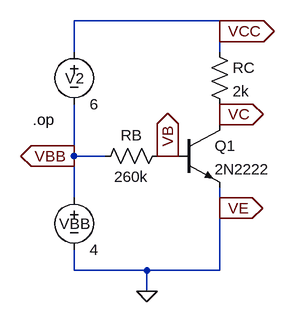
[diagram p0: schematic exam5_03c.asc]
exam5_03c.asc, the LTspice schematic file:
Version 4
SHEET 1 880 680
WIRE 224 -48 0 -48
WIRE 224 -32 224 -48
WIRE 0 0 0 -48
WIRE 224 0 224 -32
WIRE 224 96 224 80
WIRE 224 112 224 96
WIRE 0 160 0 80
WIRE 48 160 0 160
WIRE 144 160 128 160
WIRE 160 160 144 160
WIRE 0 224 0 160
WIRE 224 240 224 208
WIRE 0 336 0 304
WIRE 112 336 0 336
WIRE 224 336 224 240
WIRE 224 336 112 336
WIRE 112 368 112 336
FLAG 112 368 0
FLAG 224 -32 VCC
IOPIN 224 -32 Out
FLAG 144 160 VB
IOPIN 144 160 Out
FLAG 224 240 VE
IOPIN 224 240 Out
FLAG 0 160 VBB
IOPIN 0 160 Out
FLAG 224 96 VC
IOPIN 224 96 Out
SYMBOL npn 160 112 R0
SYMATTR InstName Q1
SYMATTR Value 2N2222
SYMBOL res 208 -16 R0
SYMATTR InstName RC
SYMATTR Value 2k
SYMBOL res 144 144 R90
WINDOW 0 0 56 VBottom 2
WINDOW 3 32 56 VTop 2
SYMATTR InstName RB
SYMATTR Value 260k
SYMBOL voltage 0 208 R0
WINDOW 0 -23 56 Left 2
SYMATTR InstName VBB
SYMATTR Value 4
SYMBOL voltage 0 -16 R0
WINDOW 0 -14 56 Left 2
SYMATTR InstName V2
SYMATTR Value 6
TEXT -64 104 Left 2 !.op

The netlist it stands for:
* exam5_03c.asc
Q1 VC VB 0 0 2N2222
RC VCC VC 2k
RB VB VBB 260k
VBB VBB 0 4
V2 VCC VBB 6
.model NPN NPN
.model PNP PNP
.lib standard.bjt
.op
.backanno
.end

* Results of the author's LTspice run, read from the files saved beside the schematic
* Operating Point:
*   V(vc) = 4.73 V
*   V(vb) = 680 mV
*   V(vcc) = 10 V
*   V(vbb) = 4 V
*   Ic(Q1) = 2.635 mA
*   Ib(Q1) = 12.77 µA
*   Ie(Q1) = -2.648 mA
*   I(Rc) = 2.635 mA
*   I(Rb) = -12.77 µA
*   I(Vbb) = -2.648 mA
*   I(V2) = -2.635 mA